# Altium schematic sheet TIMER.SchDoc: RV3028 Timer IC
size 420 x 297 mm; SheetNumber: 3
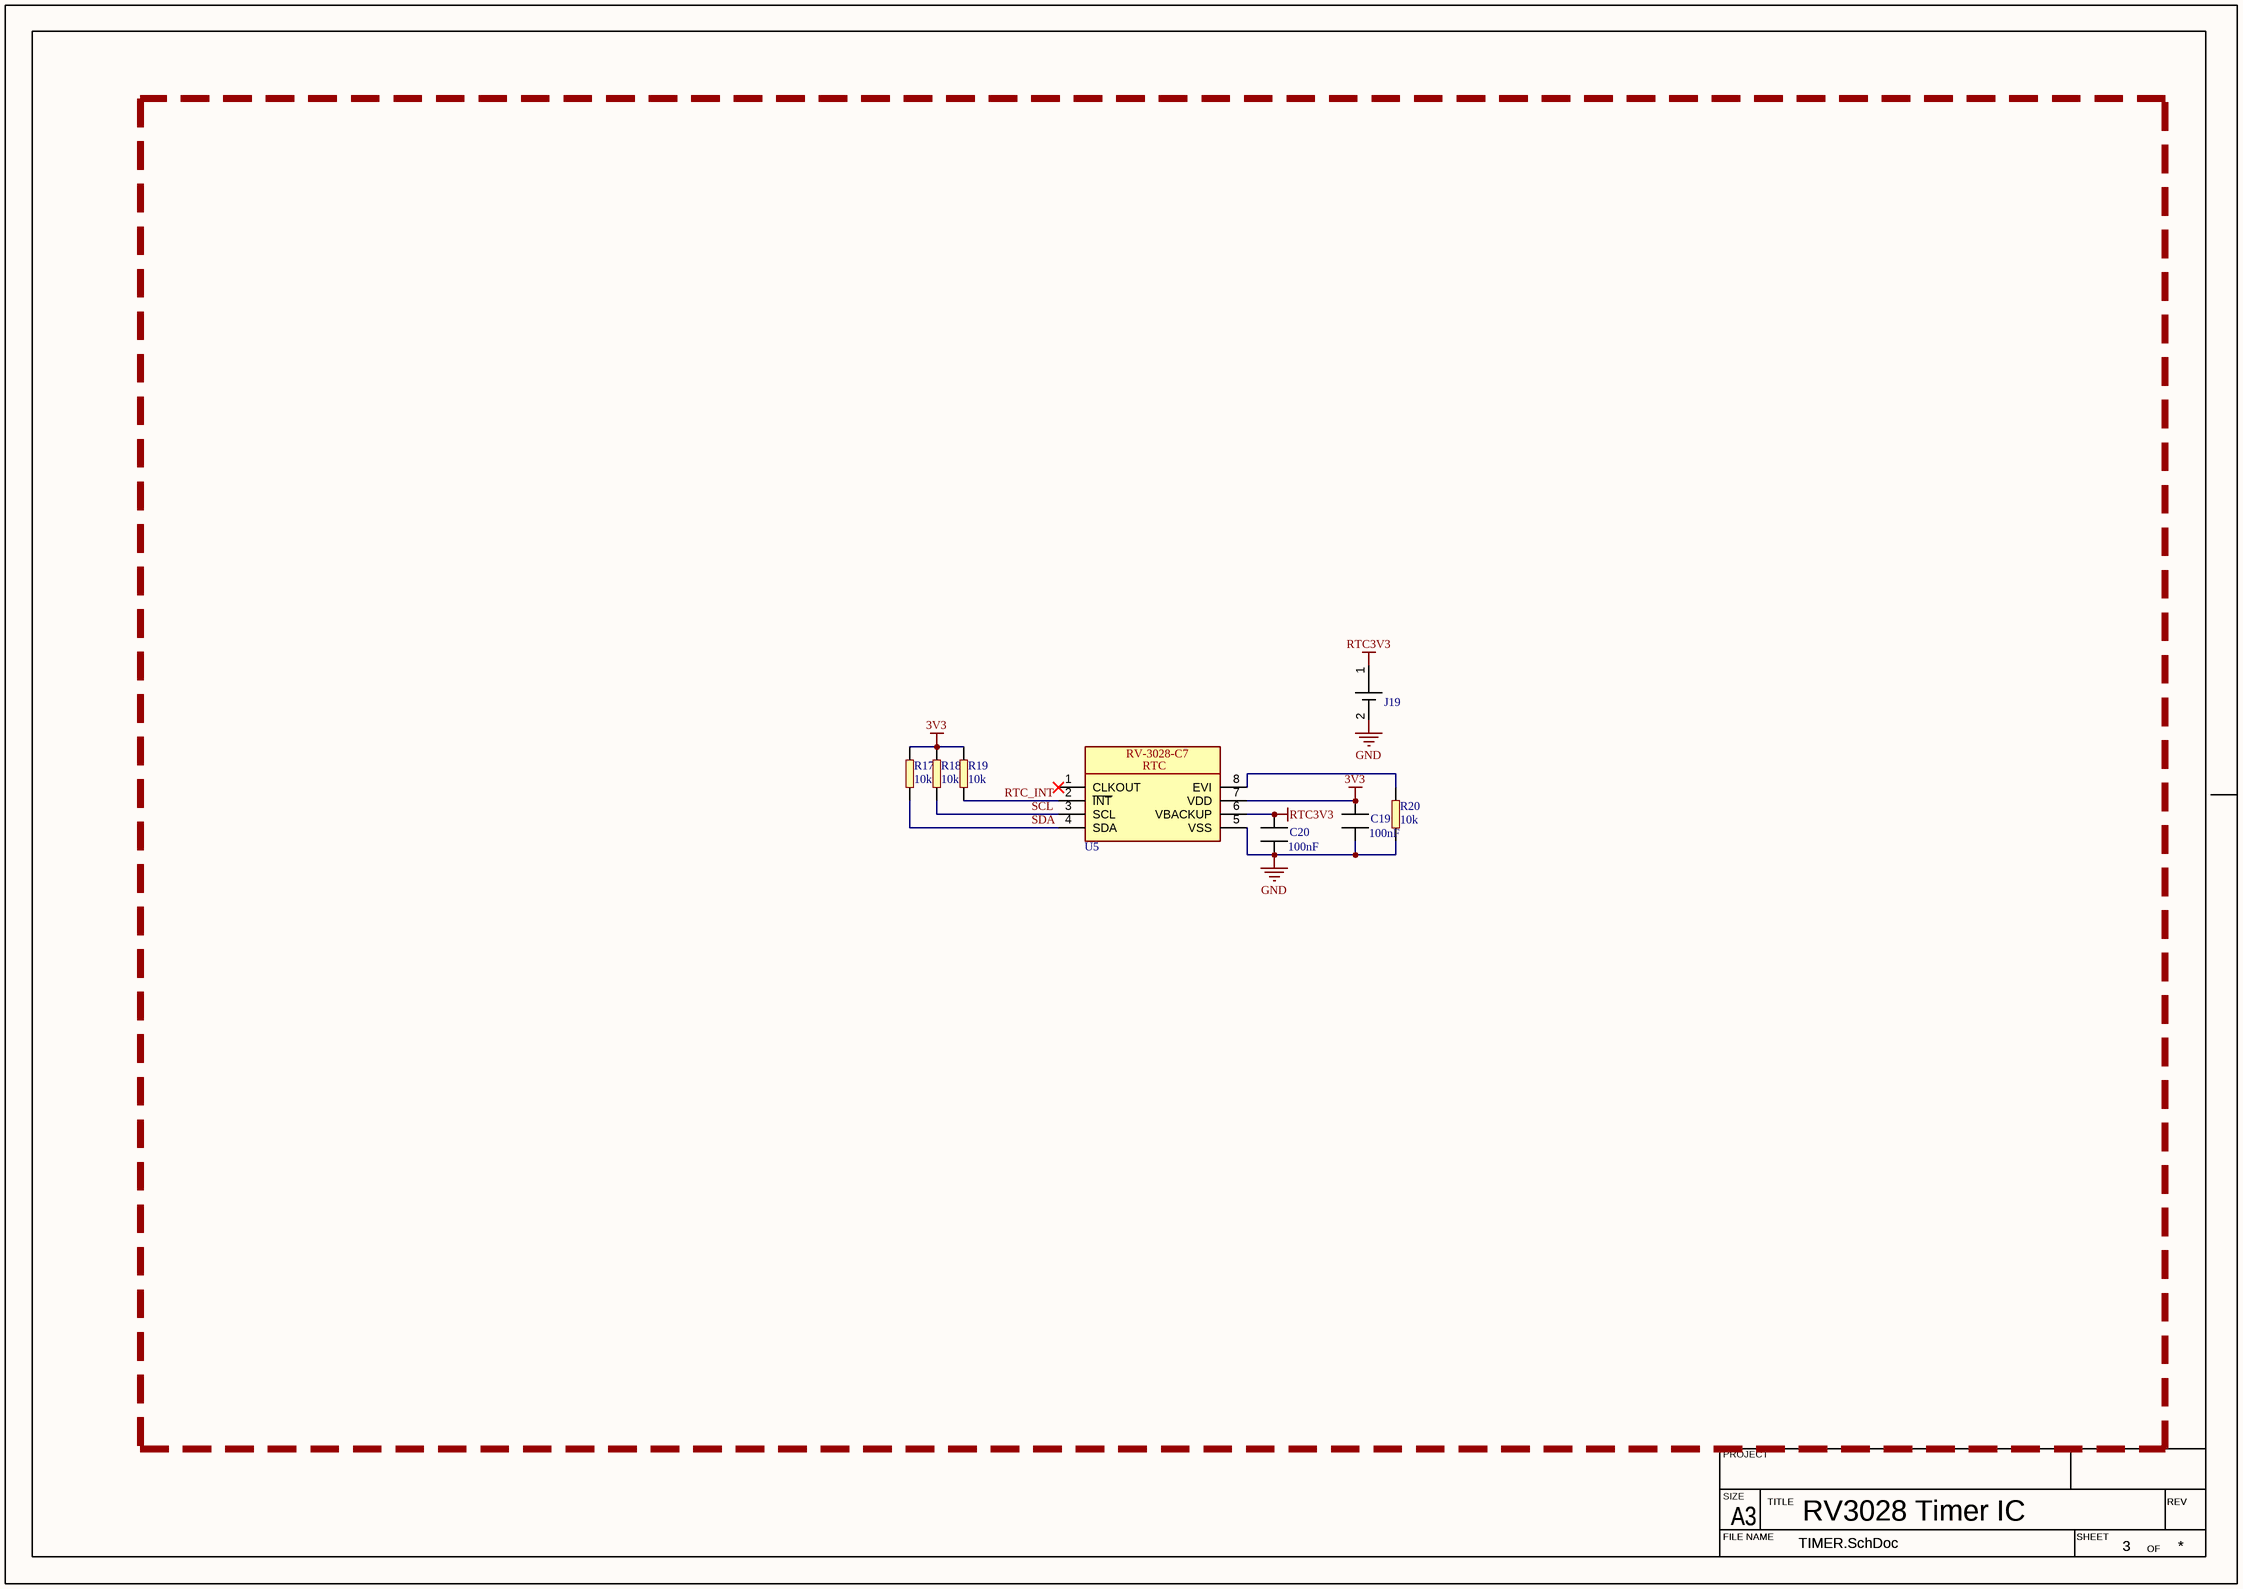
[diagram p0: TIMER.SchDoc]

## Parts
C19  value 100nF  [CAPC2012X13L]  (hidden comment: MLCC_0805)
C20  value 100nF  [CAPC2012X13L]  (hidden comment: MLCC_0805)
J19  CR1220-BH  [CR1220-BH]  (value not drawn)
R17  value 10k  [RES_0603]  (hidden comment: ERP_101-1)
R18  value 10k  [RES_0603]  (hidden comment: ERP_101-1)
R19  value 10k  [RES_0603]  (hidden comment: ERP_101-1)
R20  value 10k  [RES_0603]  (hidden comment: ERP_101-1)
U5  RV-3028-C7  [RV-3028-C7]  (value not drawn)

## Nets
3V3: C19.1 R17.2 R18.2 R19.2 U5.7(VDD)
GND: C19.2 C20.2 J19.2(-) R20.1 U5.5(VSS)
RTC3V3: C20.1 J19.1(+) U5.6(VBACKUP)
RTC_INT: R19.1 U5.2(~{INT})
SCL: R18.1 U5.3(SCL)
SDA: R17.1 U5.4(SDA)
NetR20_2: R20.2 U5.8(EVI)

Not connected (* = marked no-connect by the designer): U5 1(CLKOUT)*

## Notes on the sheet
- PROJECT
- SIZE
- FILE NAME
- A3
- TITLE
- SHEET
- OF
- REV
- (in symbol RV-3028-C7) RTC

## Library data of the parts
C19 C20 = MLCC_0805: 1uF 105 0805 (2012 metric) 50V X7R MLCC SMD; Package: 0805; Manufacturer 1: *; Manufacturer Part Number 1: *
J19 = CR1220-BH: BATTERY HOLDER COIN 12.5MM SMD; Manufacturer 1: Keystone Electronics; Value: *; Manufacturer Part Number 1: *
R17-R20 = RES_0603: Package: 0603; Manufacturer 1: *; Manufacturer Part Number 1: *; Supplier 1: *; Supplier Part Number 1: *; ERP: *
U5 = RV-3028-C7: IC RTC CLK/CALENDAR I2C 8SON; Manufacturer 1: Micro Crystal AG; Manufacturer Part Number 1: RV-3028-C7 32.768KHZ 1PPM-TA-QC; Value: *